# EAGLE design utilidong-test-OR-1.0 (EAGLE 6.5.0)
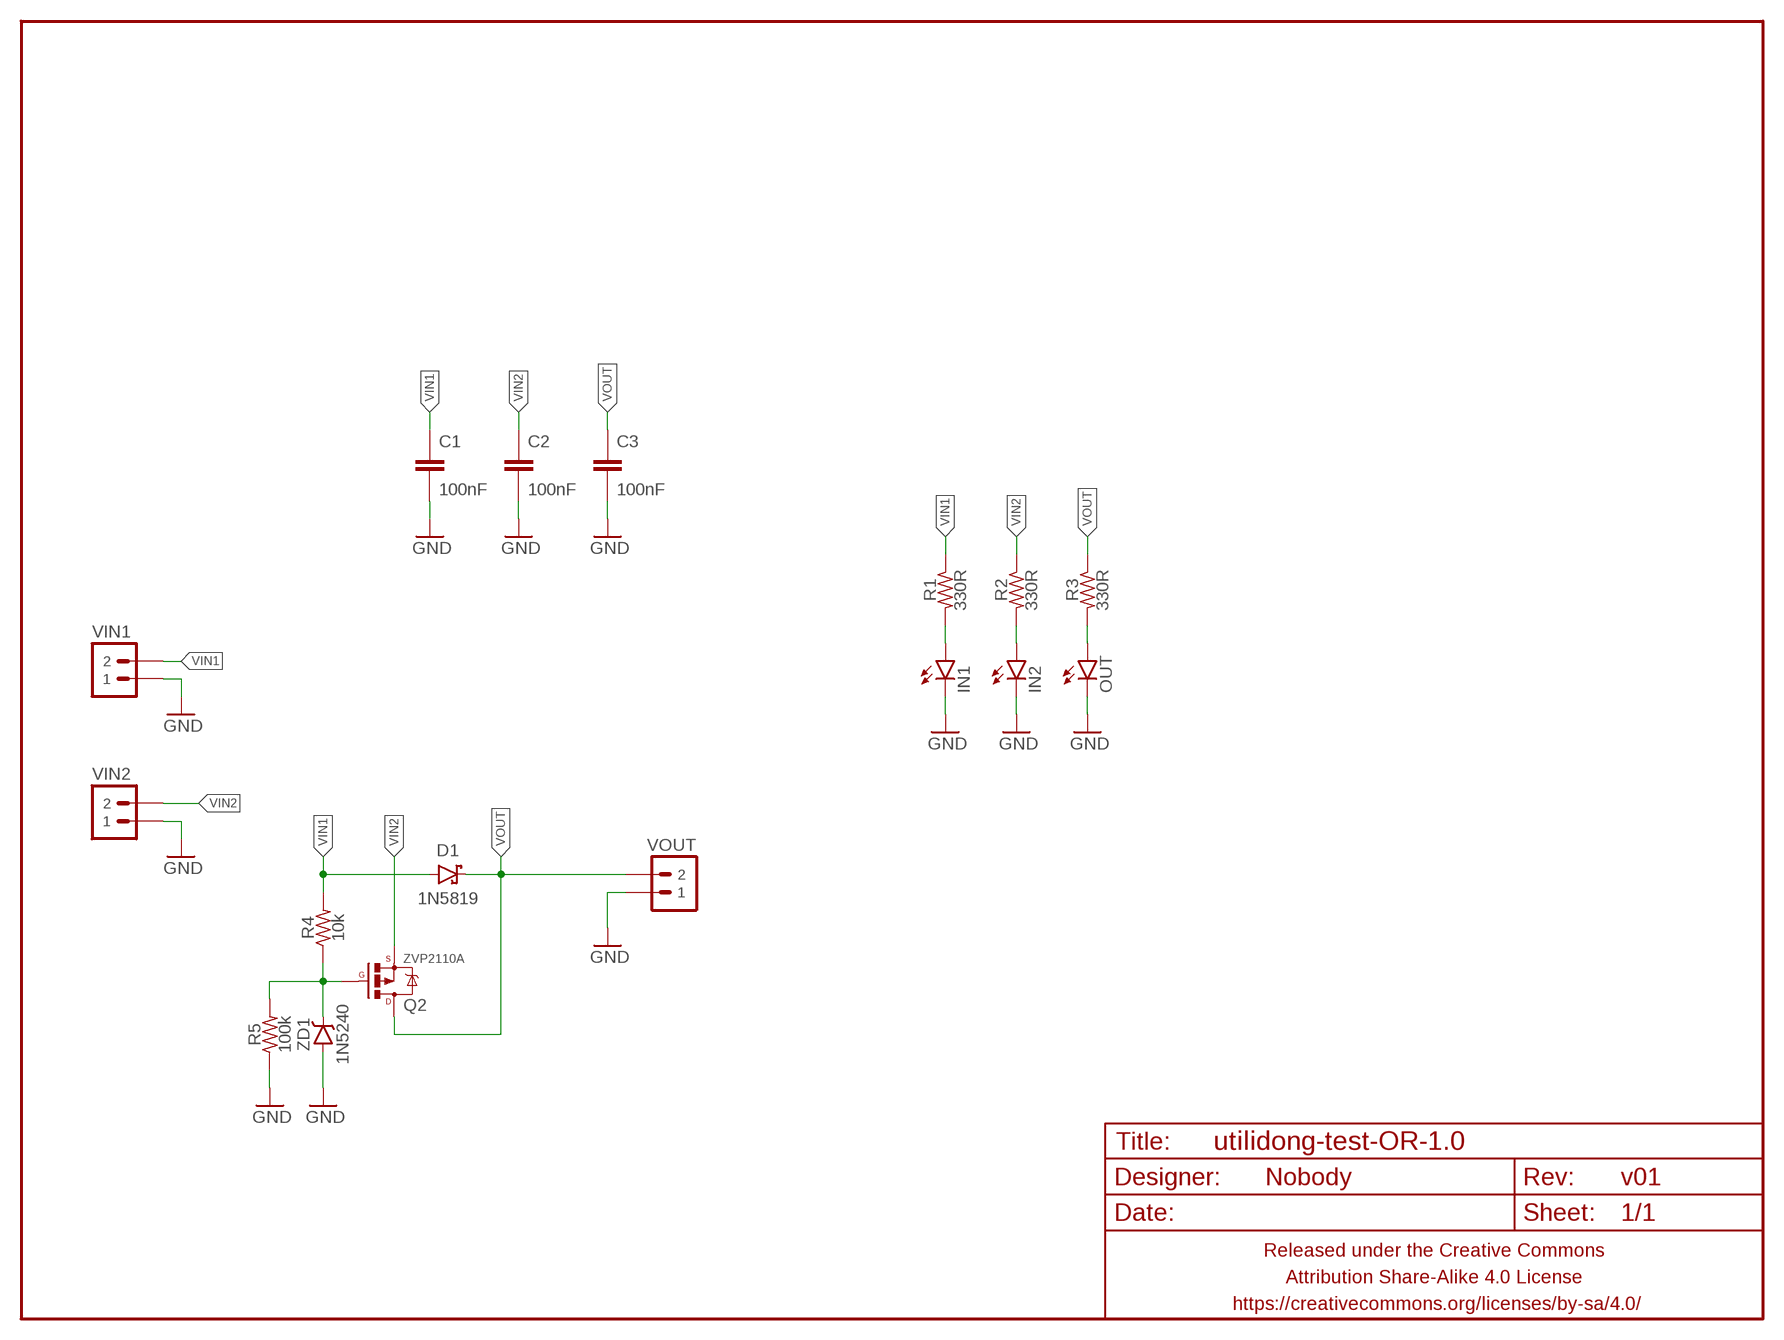
[diagram p0: schematic, sheet 1]

## Parts
C1  100nF  CAPACITOR-CERAMIC025-024X044  [C025-024X044]
C2  100nF  CAPACITOR-CERAMIC025-024X044  [C025-024X044]
C3  100nF  CAPACITOR-CERAMIC025-024X044  [C025-024X044]
D1  1N5819  DIODE-SCHOTTKYPTH-7.62MM  [DIODE-7.62MM]
FRAME1  FRAME-LETTERNO_PACKAGE  [DUMMY]
IN1  LED3MM-LESS  [LED3MM-LESSSILK]
IN2  LED3MM-LESS  [LED3MM-LESSSILK]
OUT  LED3MM-LESS  [LED3MM-LESSSILK]
Q2  ZVP2110A  MOSFET-PCHANNELTO-92-INLINE-DGS  [TO-92-AMMO]
R1  330R  RESISTORPTH-AXIAL-7.62MM  [RESISTOR-AXIAL-PTH-7.62MM]
R2  330R  RESISTORPTH-AXIAL-7.62MM  [RESISTOR-AXIAL-PTH-7.62MM]
R3  330R  RESISTORPTH-AXIAL-7.62MM  [RESISTOR-AXIAL-PTH-7.62MM]
R4  10k  RESISTORPTH-AXIAL-7.62MM  [RESISTOR-AXIAL-PTH-7.62MM]
R5  100k  RESISTORPTH-AXIAL-7.62MM  [RESISTOR-AXIAL-PTH-7.62MM]
VIN1  M02PTH-CENTERED-R+  [1X02-CENTER-R+]
VIN2  M02PTH-CENTERED-R+  [1X02-CENTER-R+]
VOUT  M02PTH-CENTERED-R+  [1X02-CENTER-R+]
ZD1  1N5240  DIODE-ZENERPTH-7.62MM  [DIODE-7.62MM]

## Nets
GND: C1.2 C2.2 C3.2 IN1.K(C) IN2.K(C) OUT.K(C) R5.P$1 VIN1.1 VIN2.1 VOUT.1 ZD1.A
N$1: IN2.A R2.P$2
N$2: OUT.A R3.P$2
N$3: IN1.A R1.P$2
N$9: Q2.2(G) R4.P$1 R5.P$2 ZD1.K(C)
VIN1: C1.1 D1.A R1.P$1 R4.P$2 VIN1.2
VIN2: C2.1 Q2.3(S) R2.P$1 VIN2.2
VOUT: C3.1 D1.K(C) Q2.1(D) R3.P$1 VOUT.2

## Library data of the parts
C1-C3 = A_butts:CAPACITOR-CERAMIC: CAPACITOR, European symbol
D1 = A_butts:DIODE-SCHOTTKY: Schottky diodes in SFE's production catalog BAT20J 1A 23V 0.62Vf RB751 120mA 40V 0.37Vf PMEG4005EJ 0.5A 40V 0.42Vf MBRA140 1A 40V 0.5Vf B340A 3A 40V SMA
FRAME1 = A_butts:FRAME-LETTER: Schematic Frame Standard 8.5x11 US Letter frame; DESIGNER: Nobody; VERSION: v01
IN1 IN2 OUT = A_butts:LED: LEDs Standard schematic elements and footprints for 5mm, 3mm, 1206, and 0603 sized LEDs. 5mm - Spark Fun Electronics SKU : COM-00529 (and others)
Q2 = A_butts:MOSFET-PCHANNEL: Generic PMOSFET IRLML2244 - TRANS-11153 (SOT-23 -20V -4.3A) (1.Gate 2.Source 3.Drain) FQP27P06 - COM-10349 <http://www.sparkfun.com/products/10349> (TO-220 -60V -27A) (1.Gate 2.Source 3.Drain)
R1-R5 = A_butts:RESISTOR: RESISTOR, American symbol
VIN1 VIN2 VOUT = A_butts:M02: Standard 2-pin 0.1" header. Use with - straight break away headers ( PRT-00116) - right angle break away headers (PRT-00553) - swiss pins (PRT-00743) - machine pins (PRT-00117) - female headers (PRT-00115) Molex polarized connector foot print use with: PRT-08233 with associated crimp pins and housings. 2.54_SCREWTERM for use with PRT-10571. 3.5mm Screw Terminal footprints for PRT-08084 5mm Screw Terminal footprints for use with PRT-08433
ZD1 = A_butts:DIODE-ZENER: Zener Diode Production Part - 8199 3.4V Zener Voltage

## Board
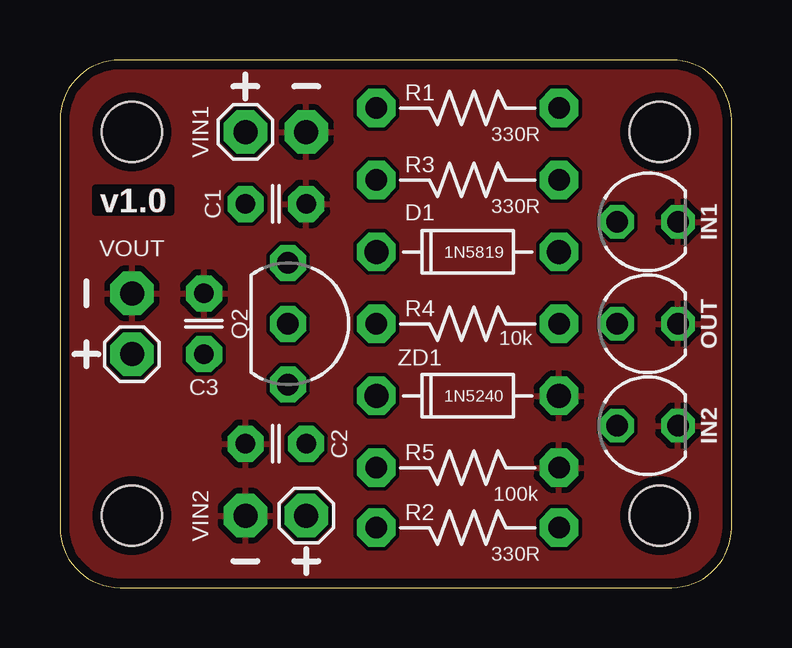
[diagram p1: board, top side]
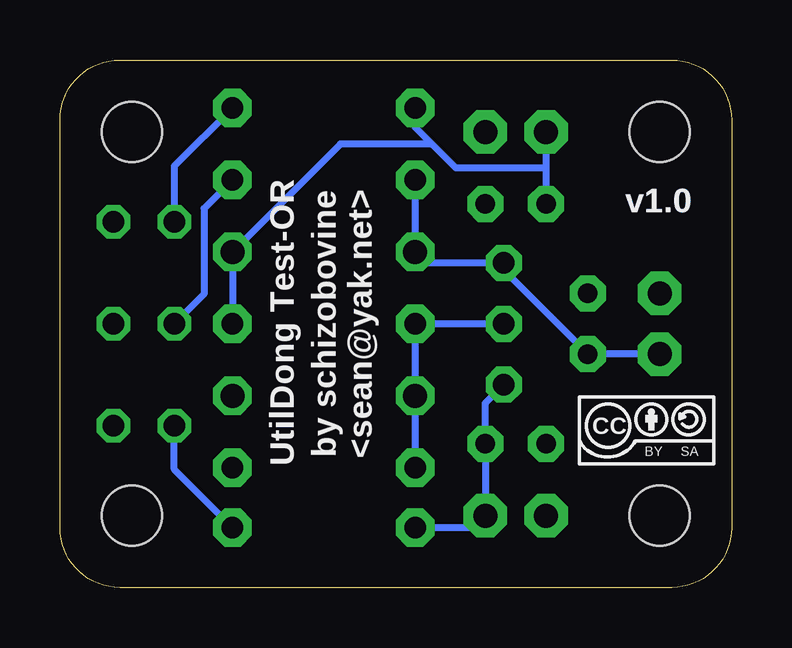
[diagram p2: board, bottom side, seen from below]

Size 28 x 22 mm. Coordinates in mm from the lower left corner, seen from the top.
Outline: 0,19.5 0,2.5 arc90 2.5,0 25.5,0 arc90 28,2.5 28,19.5 arc90 25.5,22 2.5,22 arc90 0,19.5
Copper layers (1*16): Top 0.0356mm / dielectric 1.5011mm / Bottom 0.0356mm
Design rules "LaenPCBOrder_2": minimum track width 6mil, minimum drill 13mil, track to track 6mil, track to pad 6mil, pad to pad 6mil, via to via 6mil, smd to smd 6mil, copper to edge 15mil, drill to drill 6mil, minimum pad ring 7mil, minimum via ring 7mil, stop-mask expansion 3mil, vias tented up to drill 20mil, thermal gap 10mil
Holes 2.5 mm at 25,3 25,19 3,19 3,3

### Footprints (pad centres in the part's own frame; a part is rotated, then mirrored left to right if it is on the bottom)
C025-024X044 = drill 0.813 pad 1.5 octagon: 1 -1.27,0; 2 1.27,0
DIODE-7.62MM = drill 1 pad 1.6 octagon: A -3.81,0; K 3.81,0
LED3MM-LESSSILK = drill 0.9 pad 1.4 octagon: A -1.27,0; K 1.27,0
TO-92-AMMO = drill 0.9 pad 1.5 octagon: 1 -2.54,0; 2 0,0; 3 2.54,0
RESISTOR-AXIAL-PTH-7.62MM = drill 0.9 pad 1.6 octagon: P$1 -3.81,0; P$2 3.81,0
1X02-CENTER-R+ = drill 1 pad 1.8 octagon: 1 -1.27,0; 2 1.27,0

### Placement (x,y rotation side)
C1  9,16 0 top
C2  9,6 180 top
C3  6,11 90 top
D1  17,14 180 top
FRAME1  0,0 0 top
IN1  24.5,15.25 0 top
IN2  24.5,6.75 0 top
OUT  24.5,11 0 top
Q2  9.5,11 270 top
R1  17,20 0 top
R2  17,2.5 0 top
R3  17,17 0 top
R4  17,11 0 top
R5  17,5 180 top
U$8  [CC-BY-SA-4.0-NO-URL]  3.55,6.55 0 bottom
VIN1  9,19 180 top
VIN2  9,3 0 top
VOUT  3,11 270 top
ZD1  17,8 180 top

### Tracks (layer width: path | path; a pad name or v marks a point on that pad's centre or on a via)
GND
  pour Top: -0.1,-0.1 -0.1,22.1 28.1,22.1 28.1,-0.1
N$1
  Bottom 0.3: R2.P$2 23.23,4.92 IN2.A
N$2
  Bottom 0.3: R3.P$2 22,15.81 22,12.23 OUT.A
N$3
  Bottom 0.3: R1.P$2 23.23,17.58 IN1.A
N$9
  Bottom 0.3: Q2.2 R4.P$1 ZD1.K R5.P$2
VIN1
  Bottom 0.3: VIN1.2 7.73,17.5 | 7.73,17.5 11.5,17.5 12.5,18.5 | 7.73,17.5 C1.1 | R4.P$2 D1.A 16.31,18.5 12.5,18.5 | R1.P$1 13.19,19.19 12.5,18.5
VIN2
  Bottom 0.3: R2.P$1 10.77,2.5 VIN2.2 C2.1 10.27,7.69 Q2.3
VOUT
  Bottom 0.3: R3.P$1 D1.K 12.73,13.54 Q2.1 9.5,13.23 C3.1 VOUT.2

### Text on the board
bPlace: by schizobovine / <sean@yak.net> | UtilDong Test-OR